# EAGLE design ognite (EAGLE 7.5.0)
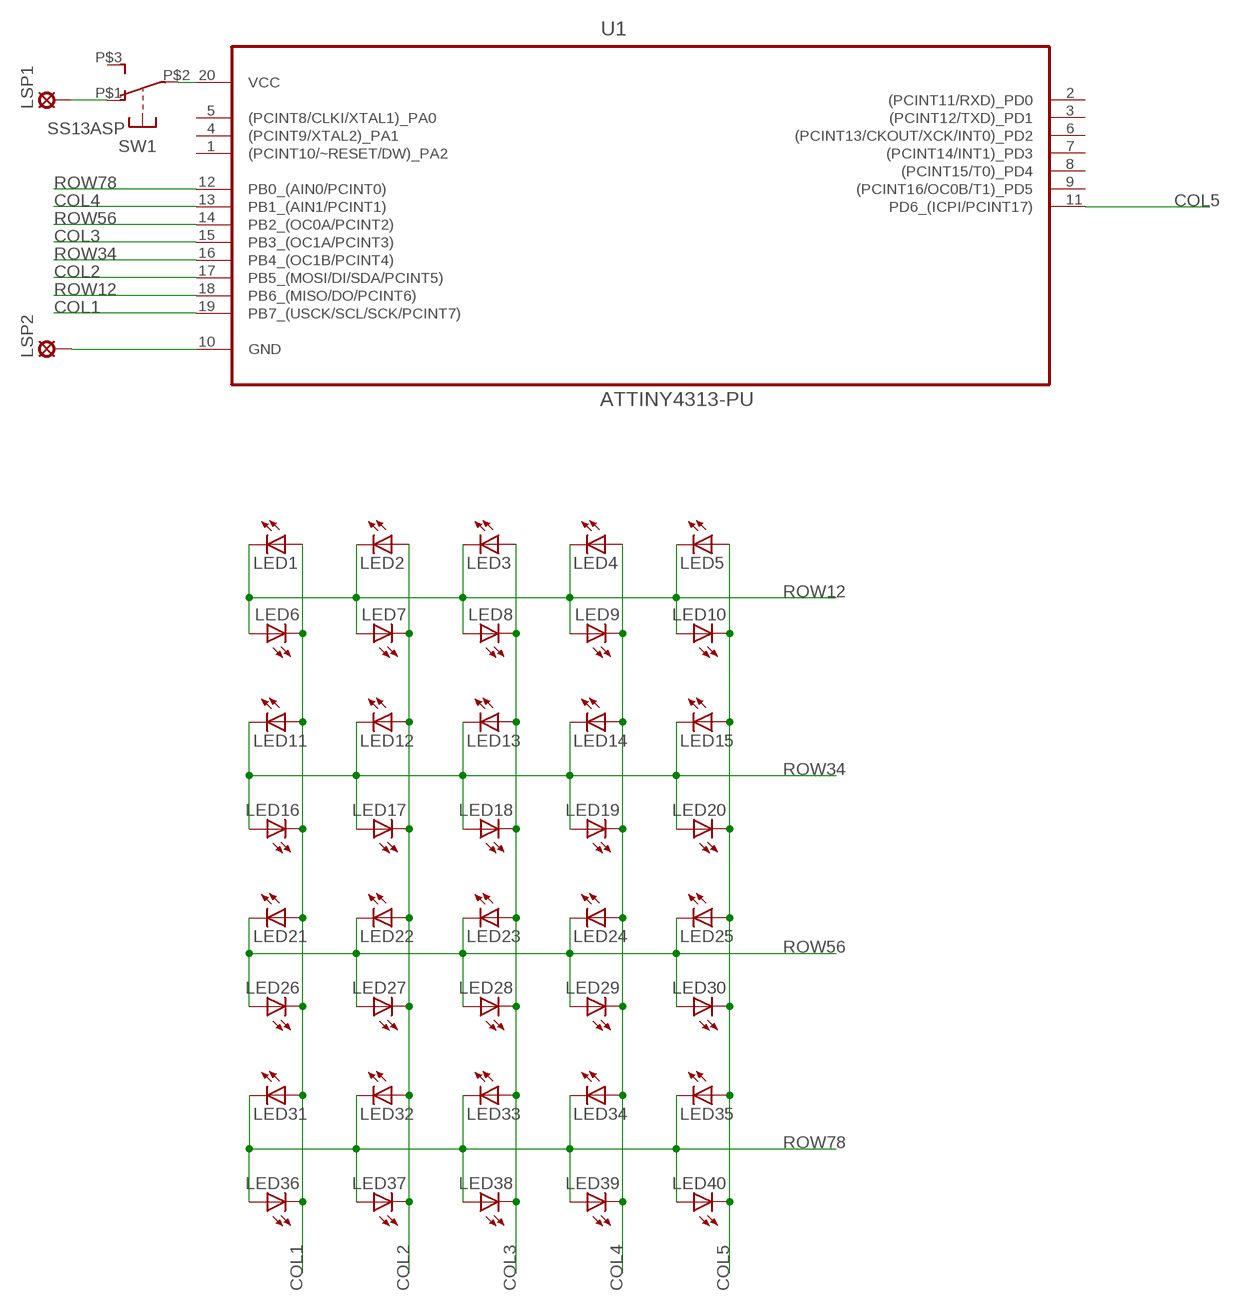
[diagram p0: schematic, sheet 1]

## Parts
LED1  LED3MM  [LED3MM]
LED2  LED3MM  [LED3MM]
LED3  LED3MM  [LED3MM]
LED4  LED3MM  [LED3MM]
LED5  LED3MM  [LED3MM]
LED6  LED3MM  [LED3MM]
LED7  LED3MM  [LED3MM]
LED8  LED3MM  [LED3MM]
LED9  LED3MM  [LED3MM]
LED10  LED3MM  [LED3MM]
LED11  LED3MM  [LED3MM]
LED12  LED3MM  [LED3MM]
LED13  LED3MM  [LED3MM]
LED14  LED3MM  [LED3MM]
LED15  LED3MM  [LED3MM]
LED16  LED3MM  [LED3MM]
LED17  LED3MM  [LED3MM]
LED18  LED3MM  [LED3MM]
LED19  LED3MM  [LED3MM]
LED20  LED3MM  [LED3MM]
LED21  LED3MM  [LED3MM]
LED22  LED3MM  [LED3MM]
LED23  LED3MM  [LED3MM]
LED24  LED3MM  [LED3MM]
LED25  LED3MM  [LED3MM]
LED26  LED3MM  [LED3MM]
LED27  LED3MM  [LED3MM]
LED28  LED3MM  [LED3MM]
LED29  LED3MM  [LED3MM]
LED30  LED3MM  [LED3MM]
LED31  LED3MM  [LED3MM]
LED32  LED3MM  [LED3MM]
LED33  LED3MM  [LED3MM]
LED34  LED3MM  [LED3MM]
LED35  LED3MM  [LED3MM]
LED36  LED3MM  [LED3MM]
LED37  LED3MM  [LED3MM]
LED38  LED3MM  [LED3MM]
LED39  LED3MM  [LED3MM]
LED40  LED3MM  [LED3MM]
LSP1  SE14  [SE14]
LSP2  SE14  [SE14]
SW1  SS13ASP  [T80-S]
U1  ATTINY4313-PU  [DIP254P762X533-20]

## Nets
COL1: LED1.A LED6.K(C) LED11.A LED16.K(C) LED21.A LED26.K(C) LED31.A LED36.K(C) U1.19(PB7_(USCK/SCL/SCK/PCINT7))
COL2: LED2.A LED7.K(C) LED12.A LED17.K(C) LED22.A LED27.K(C) LED32.A LED37.K(C) U1.17(PB5_(MOSI/DI/SDA/PCINT5))
COL3: LED3.A LED8.K(C) LED13.A LED18.K(C) LED23.A LED28.K(C) LED33.A LED38.K(C) U1.15(PB3_(OC1A/PCINT3))
COL4: LED4.A LED9.K(C) LED14.A LED19.K(C) LED24.A LED29.K(C) LED34.A LED39.K(C) U1.13(PB1_(AIN1/PCINT1))
COL5: LED5.A LED10.K(C) LED15.A LED20.K(C) LED25.A LED30.K(C) LED35.A LED40.K(C) U1.11(PD6_(ICPI/PCINT17))
GND: LSP2.MP U1.10(GND)
N$1: SW1.P$2(COM) U1.20(VCC)
N$2: LSP1.MP SW1.P$1(S1)
ROW12: LED1.K(C) LED2.K(C) LED3.K(C) LED4.K(C) LED5.K(C) LED6.A LED7.A LED8.A LED9.A LED10.A U1.18(PB6_(MISO/DO/PCINT6))
ROW34: LED11.K(C) LED12.K(C) LED13.K(C) LED14.K(C) LED15.K(C) LED16.A LED17.A LED18.A LED19.A LED20.A U1.16(PB4_(OC1B/PCINT4))
ROW56: LED21.K(C) LED22.K(C) LED23.K(C) LED24.K(C) LED25.K(C) LED26.A LED27.A LED28.A LED29.A LED30.A U1.14(PB2_(OC0A/PCINT2))
ROW78: LED31.K(C) LED32.K(C) LED33.K(C) LED34.K(C) LED35.K(C) LED36.A LED37.A LED38.A LED39.A LED40.A U1.12(PB0_(AIN0/PCINT0))
Unconnected: SW1.P$3(S2) U1.1((PCINT10/~RESET/DW)_PA2) U1.2((PCINT11/RXD)_PD0) U1.3((PCINT12/TXD)_PD1) U1.4((PCINT9/XTAL2)_PA1) U1.5((PCINT8/CLKI/XTAL1)_PA0) U1.6((PCINT13/CKOUT/XCK/INT0)_PD2) U1.7((PCINT14/INT1)_PD3) U1.8((PCINT15/T0)_PD4) U1.9((PCINT16/OC0B/T1)_PD5)

## Library data of the parts
LED1-LED40 = led:LED: LED OSRAM: - CHIPLED LG R971, LG N971, LY N971, LG Q971, LY Q971, LO R971, LY R971 LH N974, LH R974 LS Q976, LO Q976, LY Q976 LO Q996 - Hyper CHIPLED LW Q18S LB Q993, LB Q99A, LB R99A - SideLED LS A670, LO A670, LY A670, LG A670, LP A670 LB A673, LV A673, LT A673, LW A673 LH A674 LY A675 LS A676, LA A676, LO A676, LY A676, LW A676 LS A679, LY A679, LG A679 - Hyper Micro SIDELED® LS Y876, LA Y876, LO Y876, LY Y876 LT Y87S - SmartLED LW L88C, LW L88S LB L89C, LB L89S, LG L890 LS L89K, LO L89K, LY L89K LS L896, LA L896, LO L896, LY L896 - TOPLED LS T670, LO T670, LY T670, LG T670, LP T670 LSG T670, LSP T670, LSY T670, LOP T670, LYG T670 LG T671, LOG T671, LSG T671 LB T673, LV T673, LT T673, LW T673 LH T674 LS T676, LA T676, LO T676, LY T676, LB T676, LH T676, LSB T676, LW T676 LB T67C, LV T67C, LT T67C, LS T67K, LO T67K, LY T67K, LW E67C LS E67B, LA E67B, LO E67B, LY E67B, LB E67C, LV E67C, LT E67C LW T67C LS T679, LY T679, LG T679 LS T770, LO T770, LY T770, LG T770, LP T770 LB T773, LV T773, LT T773, LW T773 LH T774 LS E675, LA E675, LY E675, LS T675 LS T776, LA T776, LO T776, LY T776, LB T776 LHGB T686 LT T68C, LB T68C - Hyper Mini TOPLED® LB M676 - Mini TOPLED Santana® LG M470 LS M47K, LO M47K, LY M47K Source: http://www.osram.convergy.de LUXEON: - LUMILED® LXK2-PW12-R00, LXK2-PW12-S00, LXK2-PW14-U00, LXK2-PW14-V00 LXK2-PM12-R00, LXK2-PM12-S00, LXK2-PM14-U00 LXK2-PE12-Q00, LXK2-PE12-R00, LXK2-PE12-S00, LXK2-PE14-T00, LXK2-PE14-U00 LXK2-PB12-K00, LXK2-PB12-L00, LXK2-PB12-M00, LXK2-PB14-N00, LXK2-PB14-P00, LXK2-PB14-Q00 LXK2-PR12-L00, LXK2-PR12-M00, LXK2-PR14-Q00, LXK2-PR14-R00 LXK2-PD12-Q00, LXK2-PD12-R00, LXK2-PD12-S00 LXK2-PH12-R00, LXK2-PH12-S00 LXK2-PL12-P00, LXK2-PL12-Q00, LXK2-PL12-R00 Source: www.luxeon.com KINGBRIGHT: KA-3528ASYC Source: www.kingbright.com
LSP1 LSP2 = solpad:SE14: SOLDER PAD E1553, drill 1,4mm, distributor Buerklin, 07F820
SW1 = switch-reichelt:SS13ASP
U1 = Atmel_By_element14_Batch_1-00:ATTINY4313-PU: 8-bit Microcontroller; DESCRIPTION: 8-bit Microcontroller; MPN: ATTINY4313-PU; OC_FARNELL: 1841620; OC_NEWARK: 12T1339; PACKAGE: DIP-20; SUPPLIER: Atmel

## Net classes
0 default: clearance 0.205 mm

## Board
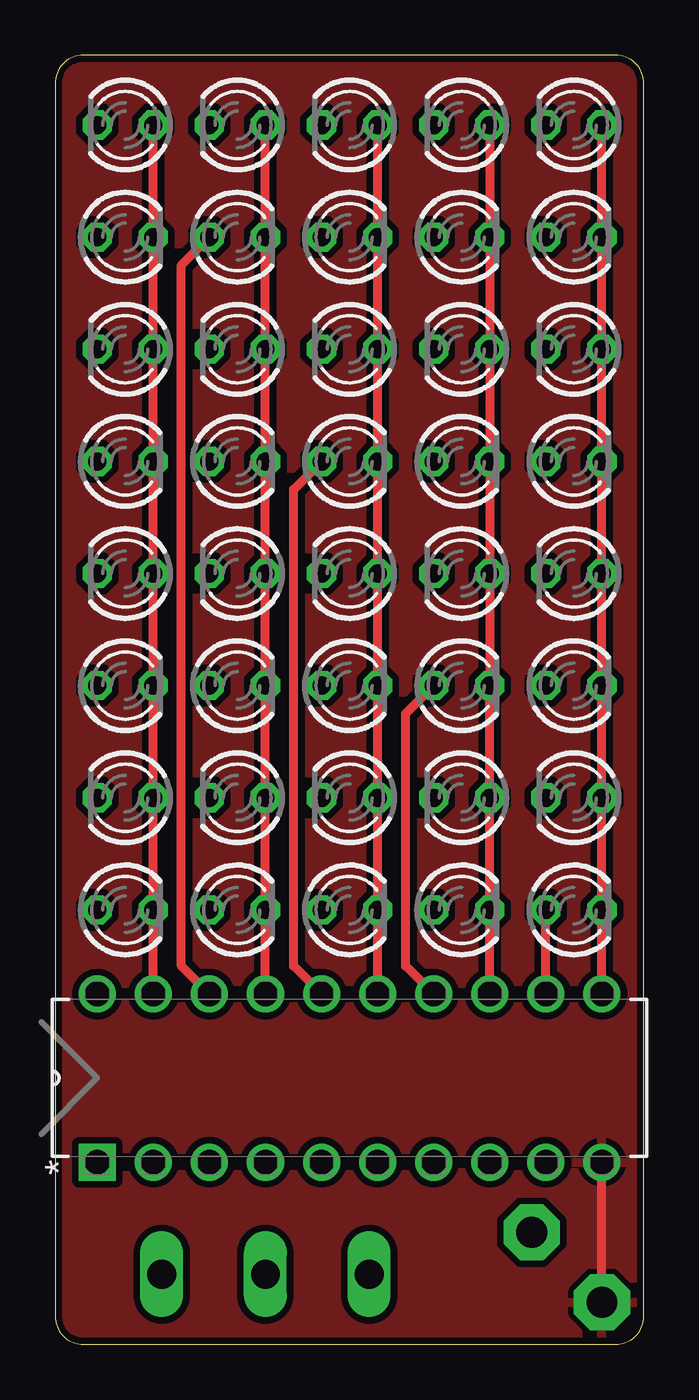
[diagram p1: board, top side]
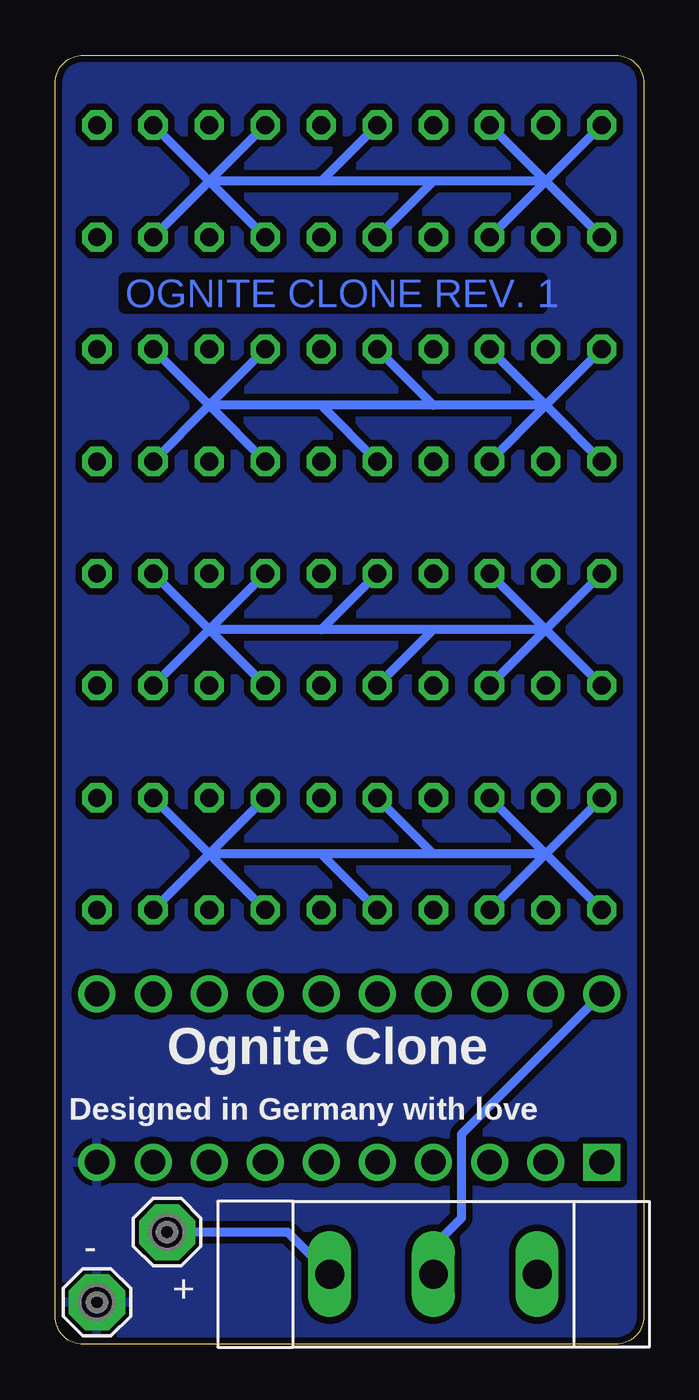
[diagram p2: board, bottom side, seen from below]

Size 26.66 x 58.41 mm. Coordinates in mm from the lower left corner, seen from the top.
Outline: 0,57.14 0,1.27 arc90 1.27,0 25.39,0 arc90 26.66,1.27 26.66,57.14 arc90 25.39,58.41 1.27,58.41 arc90 0,57.14
Copper layers (1*16): Top 0.035mm / dielectric 1.5mm / Bottom 0.035mm
Design rules "dirt_cheap_dirty_boards.v1": minimum track width 5mil, minimum drill 12mil, track to track 5mil, track to pad 5mil, pad to pad 5mil, via to via 5mil, smd to smd 0mil, copper to edge 10mil, drill to drill 10mil, minimum pad ring 10mil, minimum via ring 6mil, stop-mask expansion 2mil, vias tented up to drill 25mil, thermal gap 10mil
bRestrict: area 1.3,15.2 to 25.4,16.5; area 1.6,7.6 to 23.8,8.9

### Footprints (pad centres in the part's own frame; a part is rotated, then mirrored left to right if it is on the bottom)
LED3MM = drill 0.813 octagon: A -1.27,0; K 1.27,0
SE14 = drill 1.397 pad 2.54 octagon: MP 0,0
T80-S = drill 1.3 long: P$1 -4.699,0; P$2 0,0; P$3 4.699,0
DIP254P762X533-20 = drill 1.118 square: 1 -7.62,22.86 | drill 1.118: 2 -7.62,20.32; 3 -7.62,17.78; 4 -7.62,15.24; 5 -7.62,12.7; 6 -7.62,10.16; 7 -7.62,7.62; 8 -7.62,5.08; 9 -7.62,2.54; 10 -7.62,0; 11 0,0; 12 0,2.54; 13 0,5.08; 14 0,7.62; 15 0,10.16; 16 0,12.7; 17 0,15.24; 18 0,17.78; 19 0,20.32; 20 0,22.86

### Placement (x,y rotation side)
LED1  3.17,55.25 180 top
LED2  8.26,55.25 180 top
LED3  13.34,55.25 180 top
LED4  18.41,55.25 180 top
LED5  23.49,55.25 180 top
LED6  3.17,50.17 0 top
LED7  8.26,50.17 0 top
LED8  13.34,50.17 0 top
LED9  18.41,50.17 0 top
LED10  23.49,50.17 0 top
LED11  3.17,45.09 180 top
LED12  8.26,45.09 180 top
LED13  13.34,45.09 180 top
LED14  18.41,45.09 180 top
LED15  23.49,45.09 180 top
LED16  3.17,40.01 0 top
LED17  8.26,40.01 0 top
LED18  13.34,40.01 0 top
LED19  18.41,40.01 0 top
LED20  23.49,40.01 0 top
LED21  3.17,34.93 180 top
LED22  8.26,34.93 180 top
LED23  13.34,34.93 180 top
LED24  18.41,34.93 180 top
LED25  23.49,34.93 180 top
LED26  3.17,29.84 0 top
LED27  8.26,29.84 0 top
LED28  13.34,29.84 0 top
LED29  18.41,29.84 0 top
LED30  23.49,29.84 0 top
LED31  3.17,24.77 180 top
LED32  8.26,24.77 180 top
LED33  13.34,24.77 180 top
LED34  18.41,24.77 180 top
LED35  23.49,24.77 180 top
LED36  3.17,19.69 0 top
LED37  8.26,19.69 0 top
LED38  13.34,19.69 0 top
LED39  18.41,19.69 0 top
LED40  23.49,19.69 0 top
LSP1  21.59,5.08 0 bottom
LSP2  24.76,1.91 0 bottom
SW1  9.53,3.18 0 bottom
U1  24.76,15.88 90 top

### Tracks (layer width: path | path; a pad name or v marks a point on that pad's centre or on a via)
COL1
  Top 0.406: U1.19 LED36.K LED31.A LED26.K LED21.A LED16.K LED11.A LED6.K LED1.A
COL2
  Top 0.406: U1.17 LED37.K LED32.A LED27.K LED22.A LED17.K LED12.A LED7.K LED2.A
COL3
  Top 0.406: U1.15 LED38.K LED33.A LED28.K LED23.A LED18.K LED13.A LED8.K LED3.A
COL4
  Top 0.406: U1.13 LED39.K LED34.A LED29.K LED24.A LED19.K LED14.A LED9.K LED4.A
COL5
  Top 0.406: U1.11 LED40.K LED35.A LED30.K LED25.A LED20.K LED15.A LED10.K LED5.A
GND
  Top 0.406: LSP2.MP U1.10
  pour Bottom (isolate 0.305): -0.64,59.06 27.3,59.06 27.3,-0.63 -0.64,-0.63
  pour Top (isolate 0.305): -0.64,59.06 27.3,59.06 27.3,-0.63 -0.64,-0.63
N$1
  Bottom 0.406: U1.20 8.26,9.53 8.26,5.72 9.53,4.45 SW1.P$2
N$2
  Bottom 0.406: LSP1.MP 16.13,5.08 SW1.P$1
ROW12
  Top 0.406: U1.18 5.71,17.15 5.71,48.89 LED7.A
  Bottom 0.406: LED1.K 4.45,52.7 | 4.45,52.7 9.53,52.7 | 9.53,52.7 14.61,52.7 | 14.61,52.7 19.68,52.7 | 19.68,52.7 LED10.A | LED6.A 4.45,52.7 | LED3.K 14.61,52.7 | LED9.A 19.68,52.7 | LED4.K 19.68,52.7 | LED5.K 19.68,52.7 | LED7.A 4.45,52.7 | LED2.K 4.45,52.7 | LED8.A 9.53,52.7
ROW34
  Top 0.406: U1.16 10.79,17.15 10.79,38.73 LED18.A
  Bottom 0.406: LED11.K 4.45,42.55 | 4.45,42.55 9.53,42.55 | 9.53,42.55 14.61,42.55 | 14.61,42.55 19.68,42.55 | 19.68,42.55 LED20.A | LED15.K 19.68,42.55 | LED16.A 4.45,42.55 | LED13.K 9.53,42.55 | LED17.A 4.45,42.55 | LED12.K 4.45,42.55 | LED19.A 19.68,42.55 | LED14.K 19.68,42.55 | LED18.A 14.61,42.55
ROW56
  Top 0.406: U1.14 15.88,17.15 15.88,28.58 LED29.A
  Bottom 0.406: LED21.K 4.45,32.39 | 4.45,32.39 9.53,32.39 | 9.53,32.39 14.61,32.39 | 14.61,32.39 19.68,32.39 | 19.68,32.39 LED30.A | LED26.A 4.45,32.39 | LED23.K 14.61,32.39 | LED24.K 19.68,32.39 | LED29.A 19.68,32.39 | LED25.K 19.68,32.39 | LED28.A 9.53,32.39 | LED27.A 4.45,32.39 | LED22.K 4.45,32.39
ROW78
  Top 0.406: U1.12 LED40.A
  Bottom 0.406: LED31.K 4.45,22.23 | 4.45,22.23 9.53,22.23 | 9.53,22.23 14.61,22.23 | 14.61,22.23 19.68,22.23 | 19.68,22.23 LED40.A | LED36.A 4.45,22.23 | LED35.K 19.68,22.23 | LED32.K 4.45,22.23 | LED37.A 4.45,22.23 | LED33.K 9.53,22.23 | LED38.A 14.61,22.23 | LED39.A 19.68,22.23 | LED34.K 19.68,22.23

### Text on the board
Bottom: OGNITE CLONE REV. 1
bNames: Ognite Clone | Designed in Germany with love | - | +
tValues: ATTINY4313